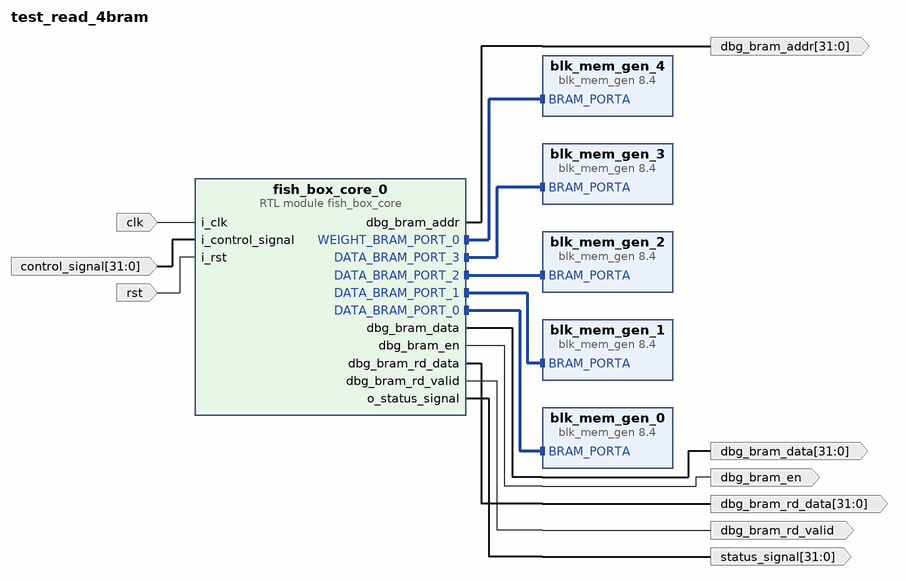
[diagram p0: block diagram of the top level]
# Vivado block design test_read_4bram, xck26-sfvc784-2LV-c, Vivado 2022.2
create_bd_design test_read_4bram

create_bd_port -dir I clk
create_bd_port -dir I rst
create_bd_port -dir O -from 31 -to 0 dbg_bram_data
create_bd_port -dir O dbg_bram_rd_valid
create_bd_port -dir O -from 31 -to 0 dbg_bram_rd_data
create_bd_port -dir O dbg_bram_en
create_bd_port -dir O -from 31 -to 0 dbg_bram_addr
create_bd_port -dir I -from 31 -to 0 control_signal
create_bd_port -dir O -from 31 -to 0 status_signal

create_bd_cell -type ip -vlnv xilinx.com:ip:blk_mem_gen:8.4 blk_mem_gen_0
set_property -dict [list \
  CONFIG.Coe_File data_bram_0.coe \
  CONFIG.Load_Init_File true \
  CONFIG.use_bram_block Stand_Alone \
] [get_bd_cells blk_mem_gen_0]
create_bd_cell -type ip -vlnv xilinx.com:ip:blk_mem_gen:8.4 blk_mem_gen_1
set_property -dict [list \
  CONFIG.Coe_File data_bram_1.coe \
  CONFIG.Load_Init_File true \
  CONFIG.use_bram_block Stand_Alone \
] [get_bd_cells blk_mem_gen_1]
create_bd_cell -type ip -vlnv xilinx.com:ip:blk_mem_gen:8.4 blk_mem_gen_2
set_property -dict [list \
  CONFIG.Coe_File data_bram_2.coe \
  CONFIG.Load_Init_File true \
  CONFIG.use_bram_block Stand_Alone \
] [get_bd_cells blk_mem_gen_2]
create_bd_cell -type ip -vlnv xilinx.com:ip:blk_mem_gen:8.4 blk_mem_gen_3
set_property -dict [list \
  CONFIG.Coe_File data_bram_3.coe \
  CONFIG.Load_Init_File true \
  CONFIG.use_bram_block Stand_Alone \
] [get_bd_cells blk_mem_gen_3]
create_bd_cell -type ip -vlnv xilinx.com:ip:blk_mem_gen:8.4 blk_mem_gen_4
set_property -dict {CONFIG.use_bram_block Stand_Alone} [get_bd_cells blk_mem_gen_4]
create_bd_cell -type module -reference fish_box_core fish_box_core_0

# ---- connections ----

connect_bd_intf_net [get_bd_intf_pins blk_mem_gen_0/BRAM_PORTA] [get_bd_intf_pins fish_box_core_0/DATA_BRAM_PORT_0]
connect_bd_intf_net [get_bd_intf_pins blk_mem_gen_1/BRAM_PORTA] [get_bd_intf_pins fish_box_core_0/DATA_BRAM_PORT_1]
connect_bd_intf_net [get_bd_intf_pins blk_mem_gen_2/BRAM_PORTA] [get_bd_intf_pins fish_box_core_0/DATA_BRAM_PORT_2]
connect_bd_intf_net [get_bd_intf_pins blk_mem_gen_3/BRAM_PORTA] [get_bd_intf_pins fish_box_core_0/DATA_BRAM_PORT_3]
connect_bd_intf_net [get_bd_intf_pins blk_mem_gen_4/BRAM_PORTA] [get_bd_intf_pins fish_box_core_0/WEIGHT_BRAM_PORT_0]
connect_bd_net [get_bd_ports clk] [get_bd_pins fish_box_core_0/i_clk]
connect_bd_net [get_bd_ports control_signal] [get_bd_pins fish_box_core_0/i_control_signal]
connect_bd_net [get_bd_pins fish_box_core_0/dbg_bram_addr] [get_bd_ports dbg_bram_addr]
connect_bd_net [get_bd_pins fish_box_core_0/dbg_bram_data] [get_bd_ports dbg_bram_data]
connect_bd_net [get_bd_pins fish_box_core_0/dbg_bram_en] [get_bd_ports dbg_bram_en]
connect_bd_net [get_bd_pins fish_box_core_0/dbg_bram_rd_data] [get_bd_ports dbg_bram_rd_data]
connect_bd_net [get_bd_pins fish_box_core_0/dbg_bram_rd_valid] [get_bd_ports dbg_bram_rd_valid]
connect_bd_net [get_bd_pins fish_box_core_0/o_status_signal] [get_bd_ports status_signal]
connect_bd_net [get_bd_ports rst] [get_bd_pins fish_box_core_0/i_rst]

validate_bd_design
save_bd_design
